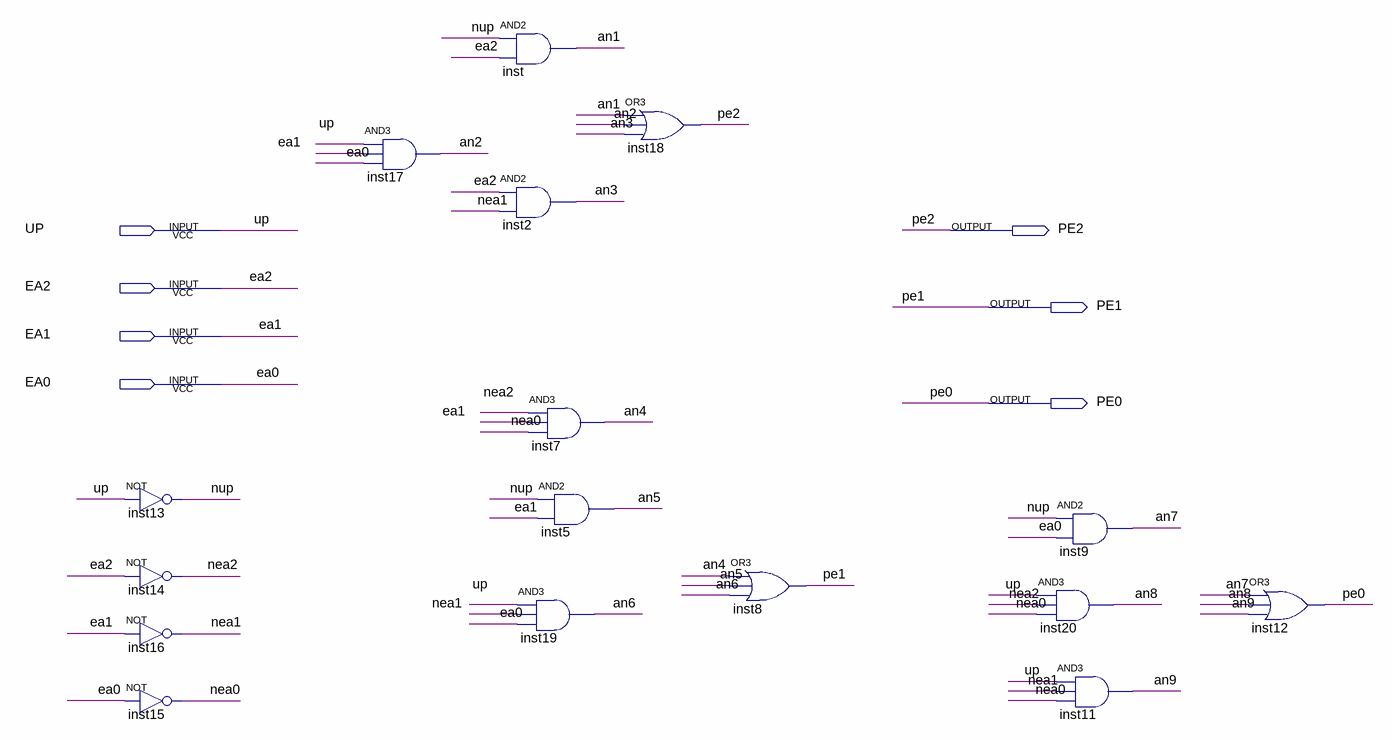
[diagram p0: schematic sheet]
// Quartus schematic ccpe.bdf as structural Verilog: 16 symbols, 7 pins
module ccpe (
  input  UP,
  input  EA2,
  input  EA1,
  input  EA0,
  output PE2,
  output PE1,
  output PE0
);

  wire an1, an2, an3, an4, an5, an6, an7, an8, an9, nea0, nea1, nea2, nup;

  not inst13 (nup, UP);
  not inst14 (nea2, EA2);
  not inst16 (nea1, EA1);
  not inst15 (nea0, EA0);
  and inst17 (an2, UP, EA1, EA0);
  and inst (an1, nup, EA2);
  and inst2 (an3, EA2, nea1);
  and inst7 (an4, nea2, EA1, nea0);
  and inst5 (an5, nup, EA1);
  and inst19 (an6, UP, nea1, EA0);
  or inst18 (PE2, an1, an2, an3);
  or inst8 (PE1, an4, an5, an6);
  and inst9 (an7, nup, EA0);
  and inst20 (an8, UP, nea2, nea0);
  and inst11 (an9, UP, nea1, nea0);
  or inst12 (PE0, an7, an8, an9);
endmodule
